# Altium schematic sheet 00-Title-Page.SchDoc: Title page.
size 297 x 209 mm; Author: Dmitry Shpakov; Organization: NoName; Revision: Revision; PageSize: A4; ProjectName: Project Name
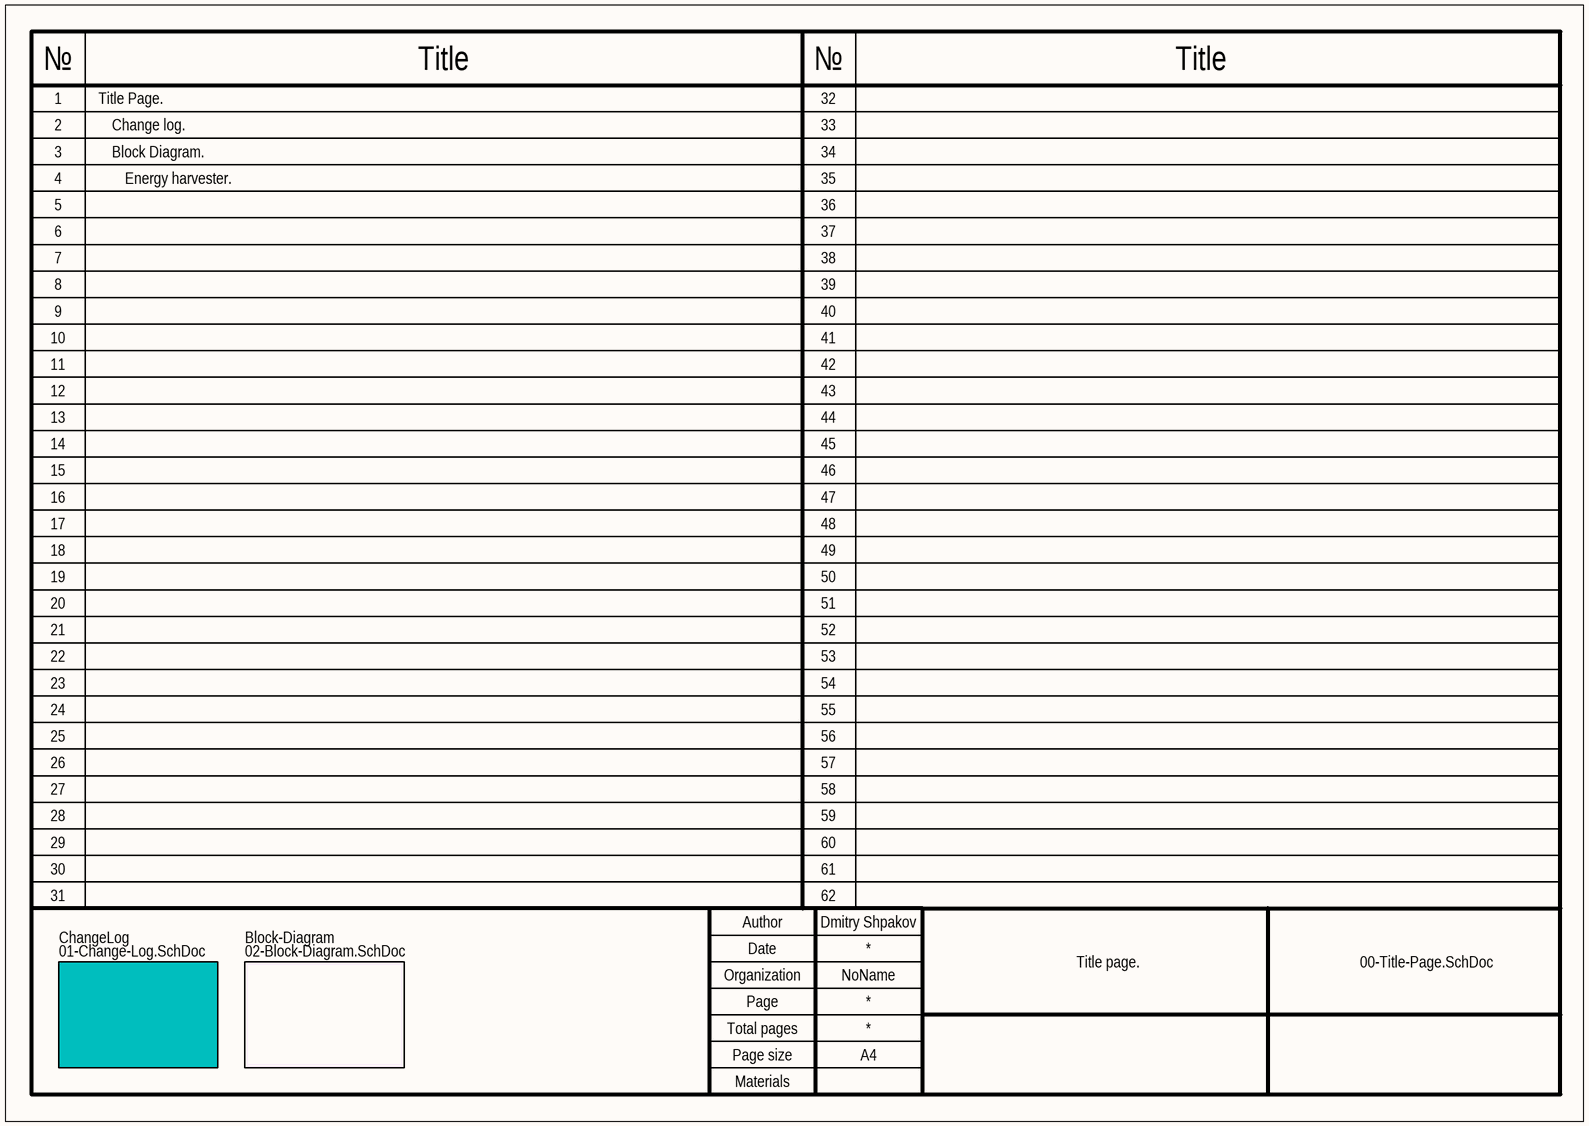
[diagram p0: 00-Title-Page.SchDoc]

## Sub-sheets
Block-Diagram = 02-Block-Diagram.SchDoc: no entries
ChangeLog = 01-Change-Log.SchDoc: no entries

## Notes on the sheet
- №
- Title
- 1
- 2
- Title Page.
- Change log.
- 32
- 33
- 3
- 4
- 5
- Block Diagram.
- Energy harvester.
- 34
- 35
- 36
- 6
- 7
- 37
- 38
- 8
- 9
- 10
- 39
- 40
- 41
- 11
- 12
- 42
- 43
- 13
- 14
- 15
- 44
- 45
- 46
- 16
- 17
- 47
- 48
- 18
- 19
- 20
- 49
- 50
- 51
- 21
- 22
- 52
- 53
- 23
- 24
- 25
- 54
- 55
- 56
- 26
- 27
- 28
- 57
- 58
- 59
- 29
- 30
- 60
- 61
- 31
- Author
- Date
- 62
- Organization
- Page
- Total pages
- Materials
- Page size